# Altium schematic sheet MCU.SchDoc: MCU
size A4; Author: Joao Guimaraes; Organization: Altium Limited; Address1: L3, 12a Rodborough Rd; Address2: Frenchs Forest; Address3: NSW; Address4: Australia 2086; Revision: 1.0.0
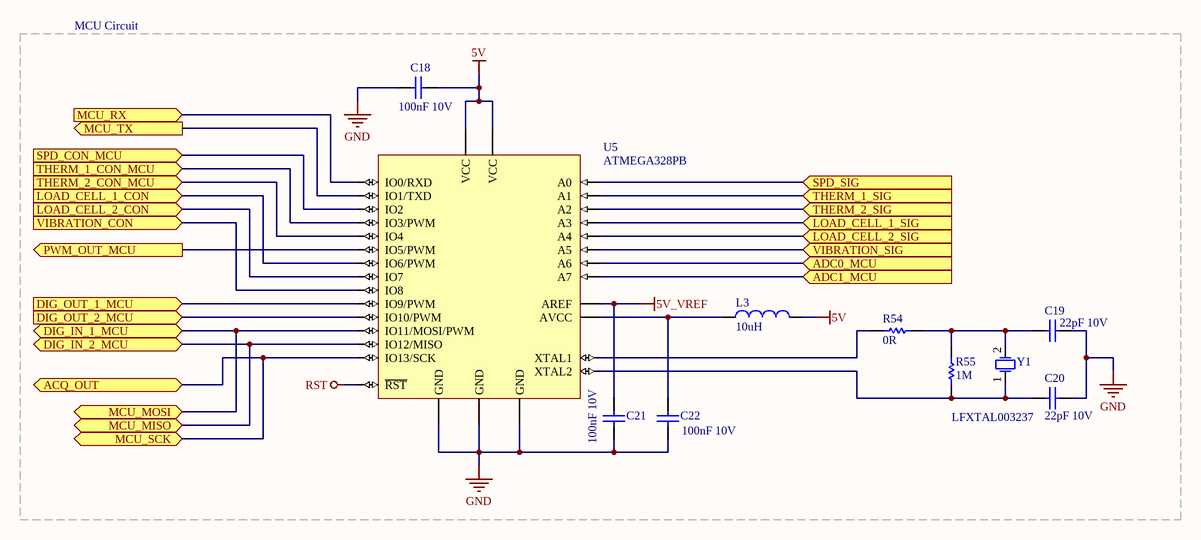
[diagram p0: MCU.SchDoc]

## Parts
C18  100nF 10V  [0402]
C19  22pF 10V  [1608[0603]]
C20  22pF 10V  [1608[0603]]
C21  100nF 10V  [0402]
C22  100nF 10V  [0402]
L3  10uH  [6-0805_M]
R54  0R  [6-0805_M]
R55  1M  [6-0805_M]
U5  ATMEGA328PB  [QFP80P900X900X120-32N]
Y1  LFXTAL003237  [HC49/4HSMX]

## Blocks framed on the sheet
MCU Circuit: C18-C22 L3 R54 R55 U5 Y1

## Ports
ACQ_OUT (bidir), ADC0_MCU (in), ADC1_MCU (in), DIG_IN_1_MCU, DIG_IN_2_MCU, DIG_OUT_1_MCU (in), DIG_OUT_2_MCU (in), LOAD_CELL_1_CON (in), LOAD_CELL_1_SIG (in), LOAD_CELL_2_CON (in), LOAD_CELL_2_SIG (in), MCU_MISO (bidir), MCU_MOSI (bidir), MCU_RX (in), MCU_SCK (bidir), MCU_TX (out), PWM_OUT_MCU (out), SPD_CON_MCU (in), SPD_SIG (in), THERM_1_CON_MCU (in), THERM_1_SIG (in), THERM_2_CON_MCU (in), THERM_2_SIG (in), VIBRATION_CON (in), VIBRATION_SIG (in)

## Nets
5V: C18.2 L3.2 U5.4(VCC) U5.6(VCC)
5V_VREF: C21.2 U5.20(AREF)
GND: C18.1 C19.2 C20.2 C21.1 C22.1 U5.3(GND) U5.5(GND) U5.21(GND)
RST: U5.29(~{RST})
ACQ_OUT: U5.17(IO13/SCK) ; port ACQ_OUT, port MCU_SCK
ADC0_MCU: U5.19(A6) ; port ADC0_MCU
ADC1_MCU: U5.22(A7) ; port ADC1_MCU
DIG_IN_1_MCU: U5.15(IO11/MOSI/PWM) ; port DIG_IN_1_MCU, port MCU_MOSI
DIG_IN_2_MCU: U5.16(IO12/MISO) ; port DIG_IN_2_MCU, port MCU_MISO
DIG_OUT_1_MCU: U5.13(IO9/PWM) ; port DIG_OUT_1_MCU
DIG_OUT_2_MCU: U5.14(IO10/PWM) ; port DIG_OUT_2_MCU
LOAD_CELL_1_CON: U5.10(IO6/PWM) ; port LOAD_CELL_1_CON
LOAD_CELL_1_SIG: U5.26(A3) ; port LOAD_CELL_1_SIG
LOAD_CELL_2_CON: U5.11(IO7) ; port LOAD_CELL_2_CON
LOAD_CELL_2_SIG: U5.27(A4) ; port LOAD_CELL_2_SIG
MCU_RX: U5.30(IO0/RXD) ; port MCU_RX
MCU_TX: U5.31(IO1/TXD) ; port MCU_TX
PWM_OUT_MCU: U5.9(IO5/PWM) ; port PWM_OUT_MCU
SPD_CON_MCU: U5.32(IO2) ; port SPD_CON_MCU
SPD_SIG: U5.23(A0) ; port SPD_SIG
THERM_1_CON_MCU: U5.1(IO3/PWM) ; port THERM_1_CON_MCU
THERM_1_SIG: U5.24(A1) ; port THERM_1_SIG
THERM_2_CON_MCU: U5.2(IO4) ; port THERM_2_CON_MCU
THERM_2_SIG: U5.25(A2) ; port THERM_2_SIG
VIBRATION_CON: U5.12(IO8) ; port VIBRATION_CON
VIBRATION_SIG: U5.28(A5) ; port VIBRATION_SIG
NetC19_1: C19.1 R54.2 R55.1 Y1.2(OSC2)
NetC20_1: C20.1 R55.2 U5.8(XTAL2) Y1.1(OSC1)
NetC22_2: C22.2 L3.1 U5.18(AVCC)
NetR54_1: R54.1 U5.7(XTAL1)

## Notes on the sheet
- Title:
- Project:
- Date:
- Author:
- Version:
- File:

## Library data of the parts
C18 C21 C22 = Cap: Capacitor; PartNumber: CAP.100n.10V.20%.SMD.0402; Manufacturer: Wurth; ClassName: MCU; Price: 0.015; Supplier: Mouser
C19 C20 = Cap: Capacitor; PartNumber: CAP.22p.10V.5%.SMD.0603; Manufacturer: Wurth; ClassName: MCU; Price: 0.10; Supplier: Mouser
L3 = Inductor: Chip Inductor; PartNumber: LBC2012T100M; Manufacturer: Taiyo Yuden; ClassName: MCU; Price: 0.20; Supplier: Mouser
R54 = Res: Resistor; PartNumber: RES.0R.1/8W.5%.SMD.0805; Manufacturer: Vishay; ClassName: MCU; Price: 0.044; Supplier: Mouser
R55 = Res: Resistor; PartNumber: RES.1M.1/8W.5%.SMD.0805; Manufacturer: Bourns; ClassName: MCU; Price: 0.012; Supplier: Mouser
U5 = ATMEGA328PB-AU: 8-bit AVR® RISC-based microcontroller (MCU) with picoPower® technology.; Manufacturer: Microchip; ClassName: MCU; PartNumber: ATMEGA328PB; Price: 1.65; Supplier: Mouser
Y1 = LFXTAL003237: Crystals 16.0MHz 13.4 x 4.9 x 4.3mm; Manufacturer: IQD; ClassName: MCU; PartNumber: LFXTAL003237; Price: 0.54; Supplier: Mouser